# Altium schematic sheet RASPBERRY=SHILED_ADS1299.SCHDOC
size A4
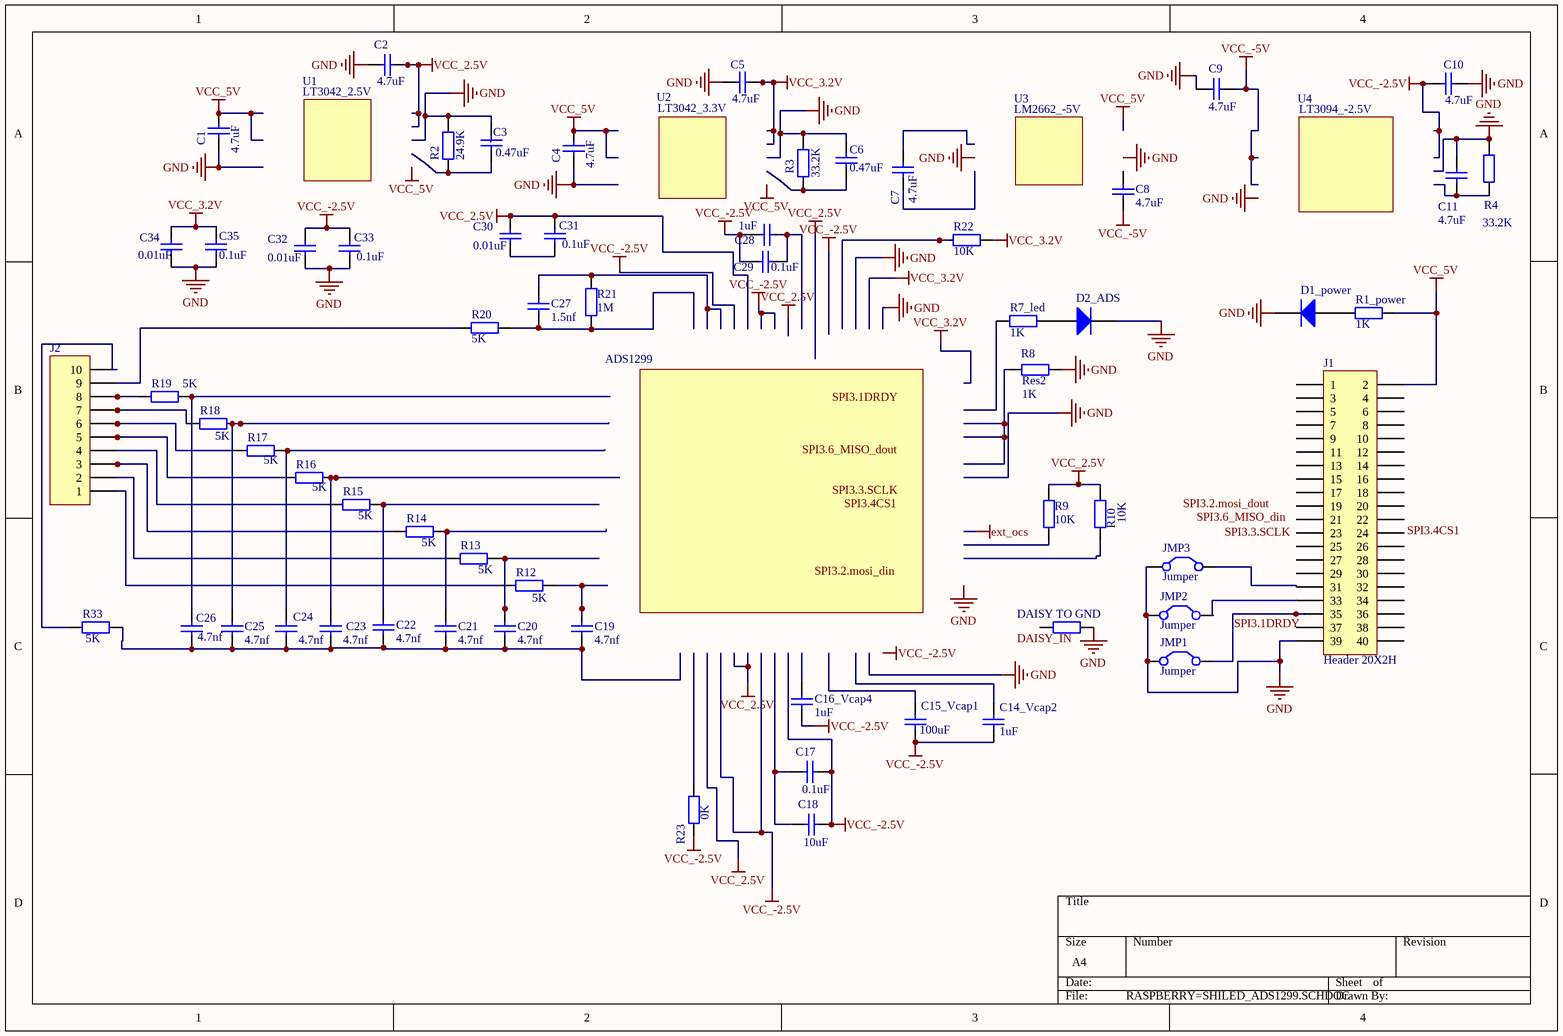
[diagram p0: RASPBERRY=SHILED_ADS1299.SCHDOC]

## Parts
C1  4.7uF  [RAD-0.3]
C2  4.7uF  [RAD-0.3]
C3  0.47uF  [RAD-0.3]
C4  4.7uF  [RAD-0.3]
C5  4.7uF  [RAD-0.3]
C6  0.47uF  [RAD-0.3]
C7  4.7uF  [RAD-0.3]
C8  4.7uF  [RAD-0.3]
C9  4.7uF  [RAD-0.3]
C10  4.7uF  [RAD-0.3]
C11  4.7uF  [RAD-0.3]
C14_Vcap2  1uF  [RAD-0.3]
C15_Vcap1  100uF  [RAD-0.3]
C16_Vcap4  1uF  [RAD-0.3]
C17  0.1uF  [RAD-0.3]
C18  10uF  [RAD-0.3]
C19  4.7nf  [RAD-0.3]
C20  4.7nf  [RAD-0.3]
C21  4.7nf  [RAD-0.3]
C22  4.7nf  [RAD-0.3]
C23  4.7nf  [RAD-0.3]
C24  4.7nf  [RAD-0.3]
C25  4.7nf  [RAD-0.3]
C26  4.7nf  [RAD-0.3]
C27  1.5nf  [RAD-0.3]
C28  1uF  [RAD-0.3]
C29  0.1uF  [RAD-0.3]
C30  value 0.1uF  [RAD-0.3]
C31  value 0.01uF  [RAD-0.3]
C32  value 0.1uF  [RAD-0.3]
C33  value 0.01uF  [RAD-0.3]
C34  value 0.1uF  [RAD-0.3]
C35  value 0.01uF  [RAD-0.3]
D1_power  (no value)  [SMC]
D2_ADS  (no value)  [SMC]
DAISY_TO_GND  (no value)  [AXIAL-0.4]
J1  Header 20X2H  [HDR2X20H]
J2  (no value)  [HDR1X10]
JMP1  Jumper  [RAD-0.2]
JMP2  Jumper  [RAD-0.2]
JMP3  Jumper  [RAD-0.2]
R1_power  1K  [AXIAL-0.4]
R2  24.9K  [AXIAL-0.4]
R3  33.2K  [AXIAL-0.4]
R4  33.2K  [AXIAL-0.4]
R7_led  1K  [AXIAL-0.4]
R8  Res2  value 1K  [AXIAL-0.4]
R9  10K  [AXIAL-0.4]
R10  10K  [AXIAL-0.4]
R12  5K  [AXIAL-0.4]
R13  5K  [AXIAL-0.4]
R14  5K  [AXIAL-0.4]
R15  5K  [AXIAL-0.4]
R16  5K  [AXIAL-0.4]
R17  5K  [AXIAL-0.4]
R18  5K  [AXIAL-0.4]
R19  5K  [AXIAL-0.4]
R20  5K  [AXIAL-0.4]
R21  1M  [AXIAL-0.4]
R22  10K  [AXIAL-0.4]
R23  0K  [AXIAL-0.4]
R33  value 5K  [AXIAL-0.4]

## Nets
GND: C1.1 C2.1 C3.2 C4.1 C5.1 C6.2 C9.1 C10.2 C11.2 C32.1 C33.1 C34.1 C35.1 D1_power.2(K) D2_ADS.2(K) DAISY_TO_GND.2 J1.39 JMP1.1(C1) JMP2.1(C1) JMP3.1(C1) R4.2 R8.2
VCC_2.5V: C2.2 C30.2 C31.2 R9.1 R10.2
VCC_3.2V: C5.2 C34.2 C35.2 R22.1
VCC_5V: C1.2 C4.2 J1.2 R1_power.2
VCC_-2.5V: C10.1 C14_Vcap2.1 C15_Vcap1.1 C16_Vcap4.1 C17.2 C18.2 C28.1 C29.1 C32.2 C33.2 R23.1
VCC_-5V: C8.1 C9.2
NetC3_1: C3.1 R2.1
NetC6_1: C6.1 R3.1
NetC11_1: C11.1 R4.1
NetC17_1: C17.1 C18.1
NetC19_1: C19.1 R12.2
NetC19_2: C19.2 C20.2 C21.2 C22.2 C23.2 C24.2 C25.1 C26.2 R33.2
NetC20_1: C20.1 R13.2
NetC21_1: C21.1 R14.2
NetC22_1: C22.1 R15.2
NetC23_1: C23.1 R16.2
NetC24_1: C24.1 R17.2
NetC25_2: C25.2 R18.2
NetC26_1: C26.1 R19.2
NetC27_1: C27.1 R20.2 R21.1
NetC27_2: C27.2 R21.2
NetC28_2: C28.2 C29.2
NetC30_1: C30.1 C31.1
NetD1_power_1: D1_power.1(A) R1_power.1
NetD2_ADS_1: D2_ADS.1(A) R7_led.1
NetJ1_31: J1.31 JMP3.2(C2)
NetJ1_33: J1.33 JMP2.2(C2)
NetJ1_35: J1.35 JMP1.2(C2)
NetJ2_1: J2.1 R12.1
NetJ2_2: J2.2 R13.1
NetJ2_3: J2.3 R14.1
NetJ2_4: J2.4 R15.1
NetJ2_5: J2.5 R16.1
NetJ2_6: J2.6 R17.1
NetJ2_7: J2.7 R18.1
NetJ2_8: J2.8 R19.1
NetJ2_9: J2.9 R20.1
NetJ2_10: J2.10 R33.1

Not connected (* = marked no-connect by the designer): C7 1 2; C8 2; C14_Vcap2 2; C15_Vcap1 2; C16_Vcap4 2; DAISY_TO_GND 1; J1 1 3 4 5 6 7 8 9 10 11 12 13 14 15 16 17 18 19 20 21 22 23 24 25 26 27 28 29 30 32 34 36 37 38 40; R2 2; R3 2; R7_led 2; R8 1; R9 2; R10 1; R22 2; R23 2

## Notes on the sheet
- (near C2) LT3042_2.5V
- U1
- U2
- (near C5) LT3042_3.3V
- LM2662_-5V
- U3
- U4
- LT3094_-2.5V
- (near R21) ADS1299
- Labels drawn without touching a wire or pin: DAISY_IN, GND, SPI3.1DRDY, SPI3.2.mosi_din, SPI3.2.mosi_dout, SPI3.3.SCLK, SPI3.4CS1, SPI3.6_MISO_din, SPI3.6_MISO_dout, VCC_5V, VCC_-2.5V

## Library data of the parts
C1-C11 C14_Vcap2 C15_Vcap1 C16_Vcap4 C17-C35 = Cap: Capacitor; Published: 8-Jun-2000; LatestRevisionDate: 17-Jul-2002; LatestRevisionNote: Re-released for DXP Platform.; PackageReference: RAD-0.3; Publisher: Altium Limited
D1_power D2_ADS = Diode: Default Diode; Published: 8-Jun-2000; LatestRevisionDate: 17-Jul-2002; LatestRevisionNote: Re-released for DXP Platform.; PackageDocument: Sep-1996; PackageReference: SMC; Publisher: Altium Limited; Code_JEDEC: DO-214-AB
DAISY_TO_GND R1_power R2-R4 R7_led R8-R10 R12-R23 R33 = Res2: Resistor; Published: 8-Jun-2000; LatestRevisionDate: 17-Jul-2002; LatestRevisionNote: Re-released for DXP Platform.; PackageReference: AXIAL-0.4; Publisher: Altium Limited
J1 = Header 20X2H: Header, 20-Pin, Dual row, Right Angle; LatestRevisionDate: 17-Jul-2002; LatestRevisionNote: Re-released for DXP Platform.; Publisher: Altium Limited
J2 = Header 10: Header, 10-Pin; LatestRevisionDate: 17-Jul-2002; LatestRevisionNote: Re-released for DXP Platform.; Publisher: Altium Limited
JMP1-JMP3 = Jumper: Jumper Wire; Published: 24-Mar-1999; LatestRevisionDate: 17-Jul-2002; LatestRevisionNote: Re-released for DXP Platform.; PackageReference: RAD-0.2; Publisher: Altium Limited